# EAGLE schematic 4ButtonBreakout (EAGLE 6.5.0)
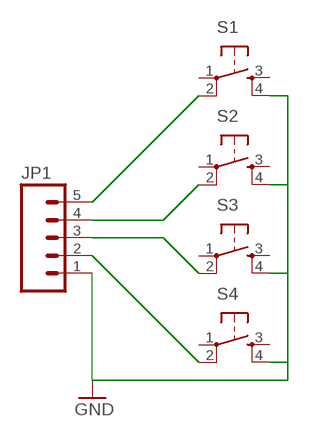
[diagram p0: schematic, sheet 1]

## Parts
JP1  M05PTH  [1X05]
S1  TAC_SWITCH12MM  [B3F_10]
S2  TAC_SWITCH12MM  [B3F_10]
S3  TAC_SWITCH12MM  [B3F_10]
S4  TAC_SWITCH12MM  [B3F_10]

## Nets
GND: JP1.1 S1.4 S2.4 S3.4 S4.4
N$1: JP1.5 S1.2
N$2: JP1.4 S2.2
N$3: JP1.3 S3.2
N$4: JP1.2 S4.2
Unconnected: S1.1 S1.3 S2.1 S2.3 S3.1 S3.3 S4.1 S4.3

## Library data of the parts
JP1 = SparkFun-Connectors:M05: Header 5 Standard 5-pin 0.1" header. Use with straight break away headers (SKU : PRT-00116), right angle break away headers (PRT-00553), swiss pins (PRT-00743), machine pins (PRT-00117), and female headers (PRT-00115). Molex polarized connector foot print use with SKU : PRT-08230 with associated crimp pins and housings.
S1-S4 = barbary_enterprises:TAC_SWITCH: Momentary Switch Button commonly used for reset or general input. Spark Fun Electronics SKU : COM-00097 SMT- SWCH-08247